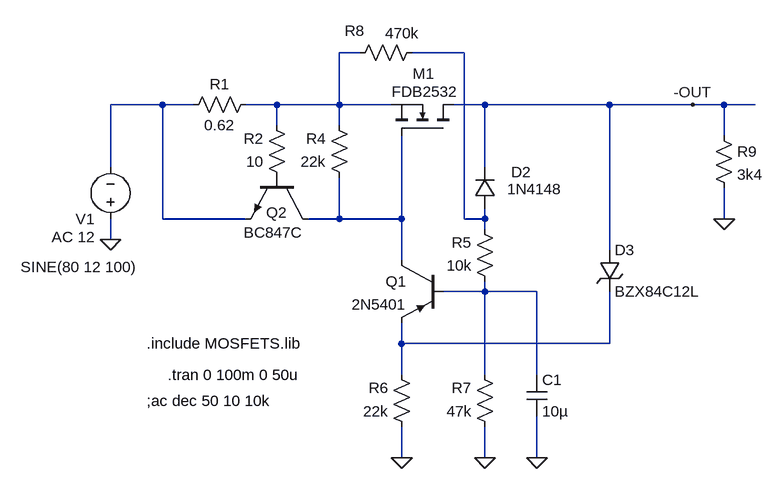
[diagram p0: schematic HV_Reg_Negative.asc]
HV_Reg_Negative.asc, the LTspice schematic file:
Version 4
SHEET 1 968 680
WIRE -208 -368 -240 -368
WIRE -48 -368 -128 -368
WIRE -512 -288 -592 -288
WIRE -464 -288 -512 -288
WIRE -336 -288 -384 -288
WIRE -240 -288 -240 -368
WIRE -240 -288 -336 -288
WIRE -160 -288 -240 -288
WIRE -16 -288 -64 -288
WIRE 176 -288 -16 -288
WIRE 304 -288 176 -288
WIRE 352 -288 304 -288
WIRE 400 -288 352 -288
WIRE -336 -256 -336 -288
WIRE -240 -256 -240 -288
WIRE 352 -240 352 -288
WIRE -592 -192 -592 -288
WIRE -16 -192 -16 -288
WIRE -512 -112 -512 -288
WIRE -384 -112 -512 -112
WIRE -240 -112 -240 -176
WIRE -240 -112 -288 -112
WIRE -144 -112 -144 -240
WIRE -144 -112 -240 -112
WIRE -48 -112 -48 -368
WIRE -16 -112 -16 -128
WIRE -16 -112 -48 -112
WIRE 352 -112 352 -160
WIRE -16 -96 -16 -112
WIRE -592 -80 -592 -112
WIRE 176 -64 176 -288
WIRE -144 -48 -144 -112
WIRE -16 0 -16 -16
WIRE -16 0 -80 0
WIRE 64 0 -16 0
WIRE -144 80 -144 48
WIRE 176 80 176 0
WIRE 176 80 -144 80
WIRE -144 128 -144 80
WIRE -16 128 -16 0
WIRE 64 128 64 0
WIRE -144 256 -144 208
WIRE -16 256 -16 208
WIRE 64 256 64 192
FLAG -144 256 0
FLAG -16 256 0
FLAG 304 -288 -OUT
FLAG 64 256 0
FLAG 352 -112 0
FLAG -592 -80 0
SYMBOL pnp -80 -48 M0
SYMATTR InstName Q1
SYMATTR Value 2N5401
SYMBOL nmos -64 -240 M270
WINDOW 0 96 29 VRight 2
WINDOW 3 68 -7 VRight 2
SYMATTR InstName M1
SYMATTR Value FDB2532
SYMBOL npn -288 -176 R90
WINDOW 0 54 32 VRight 2
WINDOW 3 85 8 VRight 2
SYMATTR InstName Q2
SYMATTR Value BC847C
SYMBOL diode 0 -128 R180
WINDOW 0 -55 56 Left 2
WINDOW 3 -103 30 Left 2
SYMATTR InstName D2
SYMATTR Value 1N4148
SYMBOL res -368 -304 R90
WINDOW 0 0 56 VBottom 2
WINDOW 3 32 56 VTop 2
SYMATTR InstName R1
SYMATTR Value 0.62
SYMBOL res -320 -160 R180
WINDOW 0 36 76 Left 2
WINDOW 3 36 40 Left 2
SYMATTR InstName R2
SYMATTR Value 10
SYMBOL res -224 -160 R180
WINDOW 0 36 76 Left 2
WINDOW 3 36 40 Left 2
SYMATTR InstName R4
SYMATTR Value 22k
SYMBOL res 0 0 R180
WINDOW 0 36 76 Left 2
WINDOW 3 36 40 Left 2
SYMATTR InstName R5
SYMATTR Value 10k
SYMBOL res -128 224 R180
WINDOW 0 36 76 Left 2
WINDOW 3 36 40 Left 2
SYMATTR InstName R6
SYMATTR Value 22k
SYMBOL res 0 224 R180
WINDOW 0 36 76 Left 2
WINDOW 3 36 40 Left 2
SYMATTR InstName R7
SYMATTR Value 47k
SYMBOL cap 48 128 R0
SYMATTR InstName C1
SYMATTR Value 10µ
SYMBOL res -224 -352 R270
WINDOW 0 34 8 VTop 2
WINDOW 3 62 81 VBottom 2
SYMATTR InstName R8
SYMATTR Value 470k
SYMBOL res 336 -256 R0
SYMATTR InstName R9
SYMATTR Value 3k4
SYMBOL voltage -592 -96 R180
WINDOW 123 24 -12 Left 2
WINDOW 39 0 0 Left 2
WINDOW 3 -42 -58 Left 2
SYMATTR Value2 AC 12
SYMATTR Value SINE(80 12 100)
SYMATTR InstName V1
SYMBOL zener 160 -64 R0
SYMATTR InstName D3
SYMATTR Value BZX84C12L
SYMATTR Description Diode
SYMATTR Type diode
TEXT -536 80 Left 2 !.include MOSFETS.lib
TEXT -504 128 Left 2 !.tran 0 100m 0 50u
TEXT -536 168 Left 2 !;ac dec 50 10 10k

The netlist it stands for:
* HV_Reg_Negative.asc
Q1 N004 N005 N006 0 2N5401
M1 -OUT N004 N001 N001 FDB2532
Q2 N004 P001 N003 0 BC847C
D2 N002 -OUT 1N4148
R1 N001 N003 0.62
R2 P001 N001 10
R4 N004 N001 22k
R5 N005 N002 10k
R6 0 N006 22k
R7 0 N005 47k
C1 N005 0 10µ
R8 N001 N002 470k
R9 -OUT 0 3k4
V1 0 N003 SINE(80 12 100) AC 12
D3 -OUT N006 BZX84C12L
.model D D
.lib standard.dio
.model NPN NPN
.model PNP PNP
.lib standard.bjt
.model NMOS NMOS
.model PMOS PMOS
.lib standard.mos
.include MOSFETS.lib
.tran 0 100m 0 50u
;ac dec 50 10 10k
.backanno
.end